# EAGLE design ESP32_Tiny (EAGLE 9.5.2)
DATE: 22-04-2019; REV: V1 P3; TITLE: TinyPICO
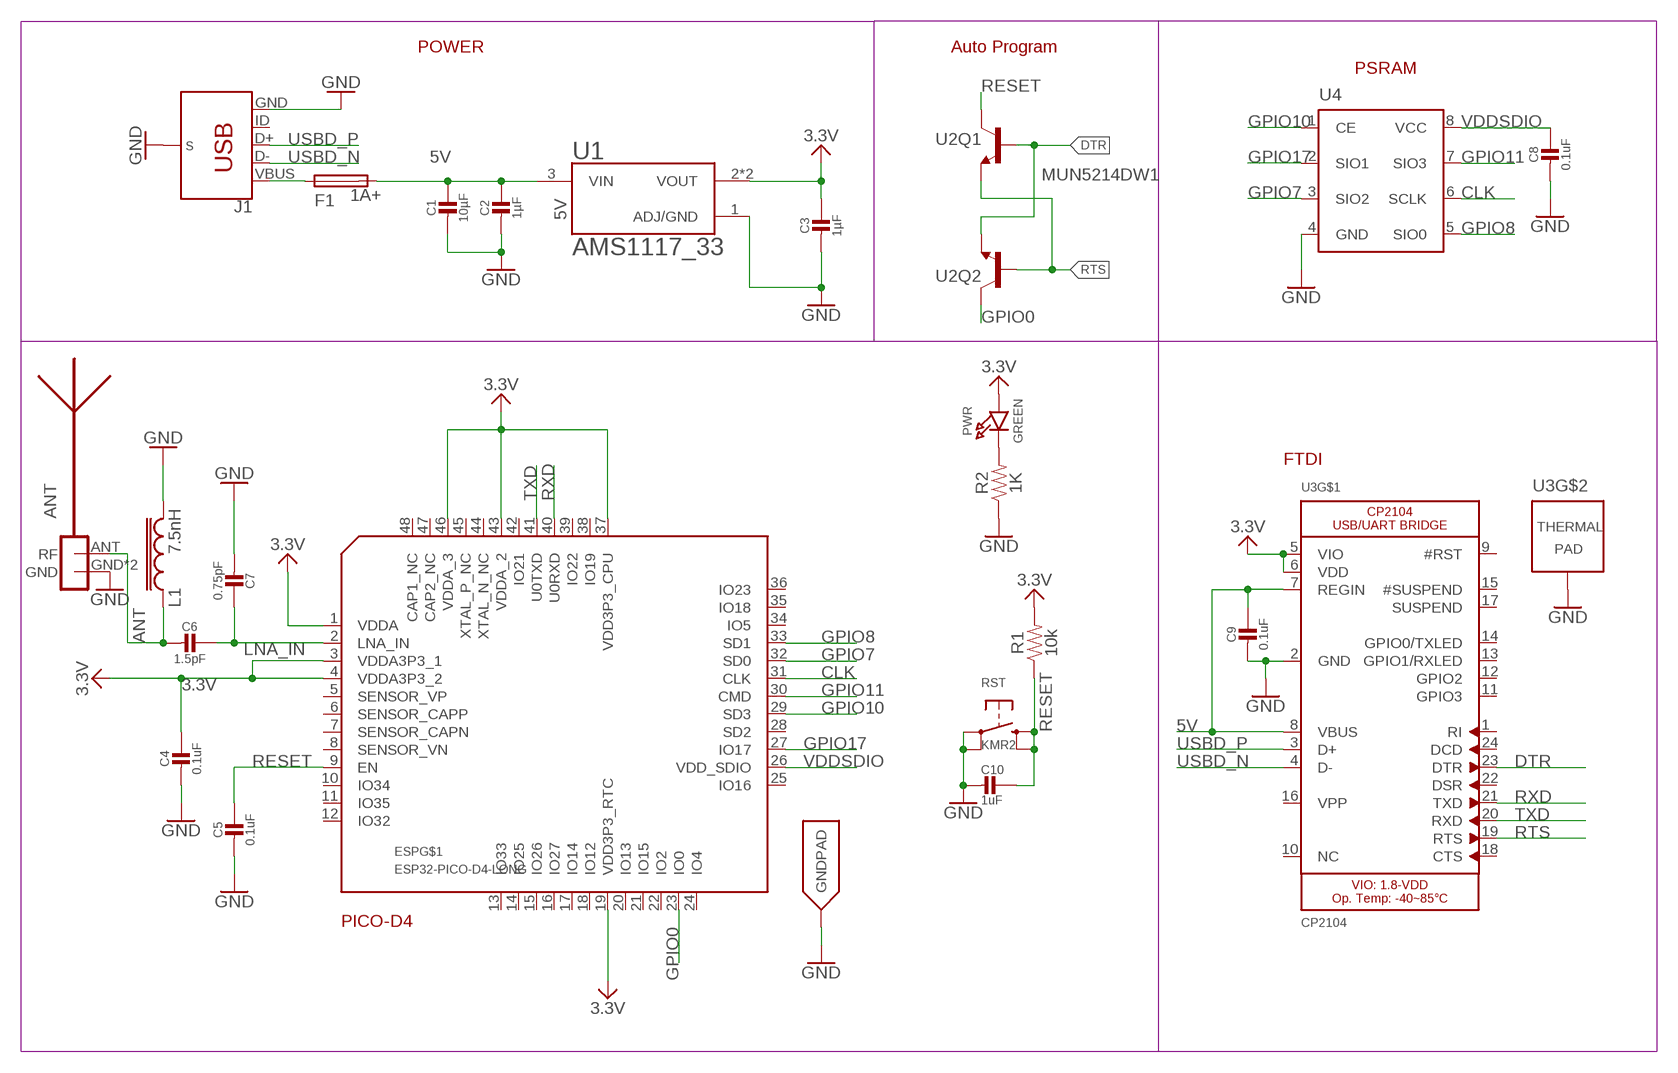
[diagram p0: schematic, sheet 1]

## Parts
ANT  AN043_2.45GREV1_RIGHT  [AN043_RIGHT]
C1  10µF  CAP_CERAMIC_0805  [0805]
C2  1µF  CAP_CERAMIC_0603  [0603]
C3  1µF  CAP_CERAMIC_0603  [0603]
C4  0.1uF  CAP_CERAMIC_0603  [0603]
C5  0.1uF  CAP_CERAMIC_0603  [0603]
C6  1.5pF  CAP_CERAMIC_0603  [0603]
C7  0.75pF  CAP_CERAMIC_0603  [0603]
C8  0.1uF  CAP_CERAMIC_0603  [0603]
C9  0.1uF  CAP_CERAMIC_0603  [0603]
C10  1uF  CAP_CERAMIC_0603  [0603]
ESP  ESP32-PICO-D4-LONG  [PICO-D4-QFN48-LONG]
F1  1A+  FUSE-1206  [1206]
J1  USB-MICRO-B-SOCKET-2  [USB-MICRO-B-SOCKET-2]
L1  7.5nH  INDUCTOR-0603  [0603]
PWR  GREEN  LED0603  [CHIPLED_0603]
R1  10k  RESISTOR0603  [0603]
R2  1K  RESISTOR0603  [0603]
RST  KMR2  SWITCH_TACT_SMT4.6X2.8  [BTN_KMR2_4.6X2.8]
U1  AMS1117_33  VREG_AMS1117SMALL  [SOT89]
U2  MUN5214DW1  NPN_MBT3904DW1T1  [DUAL_NPN_SC70-6]
U3  CP2104  FTDI_CP2104LONG  [QFN24_4MM_SMSC_LONG]
U4  LY68L6400SLIT  PSRAM_LY68L6400SLIT  [SOP8]

## Nets
3.3V: C3.1 C4.1 ESP.1(VDDA) ESP.3(VDDA3P3_1) ESP.4(VDDA3P3_2) ESP.19(VDD3P3_RTC) ESP.37(VDD3P3_CPU) ESP.43(VDDA_2) ESP.46(VDDA_3) PWR.A R1.2 U1.2(VOUT) U1.2@1(VOUT) U3.5(VIO) U3.6(VDD) ; supply symbol labelled SUPPLY_3.3V
5V: C1.1 C2.1 C9.1 F1.2 U1.3(VIN) U3.7(REGIN) U3.8(VBUS)
ANT: ANT.ANT(RF) C6.2 L1.1
CLK: ESP.31(CLK) U4.6(SCLK)
DTR: U2.1(Q2:E) U2.5(Q1:B) U3.23(DTR)
GND: ANT.GND ANT.GND-PAD1(GND) C1.2 C2.2 C3.2 C4.2 C5.2 C7.2 C8.2 C9.2 C10.2 ESP.EXP(GNDPAD) J1.GND J1.S1(SHIELD) J1.S2(SHIELD) J1.S3(SHIELD) J1.S4(SHIELD) J1.S5(SHIELD) L1.2 R2.1 RST.A'(P1) RST.A(P) U1.1(ADJ/GND) U3.2(GND) U3.THERM(TP) U4.4(GND) ; supply symbol labelled SUPPLY_GND
GPIO0: ESP.23(IO0) U2.6(Q2:C)
GPIO7: ESP.32(SD0) U4.3(SIO2)
GPIO8: ESP.33(SD1) U4.5(SIO0)
GPIO10: ESP.29(SD3) U4.1(CE)
GPIO11: ESP.30(CMD) U4.7(SIO3)
GPIO17: ESP.27(IO17) U4.2(SIO1)
LNA_IN: C6.1 C7.1 ESP.2(LNA_IN)
N$1: F1.1 J1.VBUS
N$2: PWR.C R2.2
RESET: C5.1 C10.1 ESP.9(EN) R1.1 RST.B'(S1) RST.B(S) U2.3(Q1:C)
RTS: U2.2(Q2:B) U2.4(Q1:E) U3.19(RTS)
RXD: ESP.40(U0RXD) U3.21(TXD)
TXD: ESP.41(U0TXD) U3.20(RXD)
USBD_N: J1.D- U3.4(D-)
USBD_P: J1.D+ U3.3(D+)
VDDSDIO: C8.1 ESP.26(VDD_SDIO) U4.8(VCC)
Unconnected: ESP.5(SENSOR_VP) ESP.6(SENSOR_CAPP) ESP.7(SENSOR_CAPN) ESP.8(SENSOR_VN) ESP.10(IO34) ESP.11(IO35) ESP.12(IO32) ESP.13(IO33) ESP.14(IO25) ESP.15(IO26) ESP.16(IO27) ESP.17(IO14) ESP.18(IO12) ESP.20(IO13) ESP.21(IO15) ESP.22(IO2) ESP.24(IO4) ESP.25(IO16) ESP.28(SD2) ESP.34(IO5) ESP.35(IO18) ESP.36(IO23) ESP.38(IO19) ESP.39(IO22) ESP.42(IO21) ESP.44(XTAL_N_NC) ESP.45(XTAL_P_NC) ESP.47(CAP2_NC) ESP.48(CAP1_NC) J1.ID U3.1(RI) U3.9(#RST) U3.10(NC) U3.11(GPIO3) U3.12(GPIO2) U3.13(GPIO1/RXLED) U3.14(GPIO0/TXLED) U3.15(#SUSPEND) U3.16(VPP) U3.17(SUSPEND) U3.18(CTS) U3.22(DSR) U3.24(DCD)

## Notes on the sheet
- POWER | Auto Program
- PSRAM
- FTDI
- PICO-D4

## Library data of the parts
ANT = Scott-RF:AN043_2.45G
C1-C10 = Scott-Electrical:CAP_CERAMIC
ESP = Scott-MCU:ESP32-PICO-D4
F1 = Scott-Electrical:FUSE
J1 = Scott-Connectors:USB-MICRO-B-SOCKET-
L1 = Scott-Electrical:INDUCTOR
PWR = Scott-Electrical:LED: LED 0603 - 0603 Surface Mount Package 2mA: Green LED - Low Power (3.9mcd, 2ma, 1.7Vf) - Digikey: 475-2709-2-ND Orange LED - Low Power (9.8mcd, 2ma, 1.8Vf) - Digikey: 475-1194-2-ND Red LED - Low Power (5mcd, 2ma, 1.8Vf) - Digikey: 475-1195-2-ND Yellow LED - Low Power (7mcd, 2ma, 1.8Vf) - Digikey: 475-1196-2-ND 5mA: Blue LED - Low Power (17mcd, 5ma, 2.9Vf) - Digikey: LNJ937W8CRACT-ND 0805 - 0805 Surface Mount Package 2mA: Red LED (8.8mcd, 2mA, 1.8Vf, Clear) - Low Power [Digikey: 475-2510-1-ND] Green LED (5mcd, 2mA, 1.8Vf, Clear) - Low Power [Digikey: 475-2730-1-ND] Yellow LED (11.3mcd, 2mA, 1.8Vf, Clear) - Low Power [Digikey: 475-2555-1-ND] 20mA: Red LED (104mcd, 20mA, Diffused) - LS R976 [Digikey: 475-1278-6-ND] Red LED (12mcd, 20mA, 2.0Vf, Clear) - APT2012EC [Digikey: 754-1128-1-ND] Green LED (15mcd, 20mA, 2.2Vf, Clear) - APT2012GC [Digikey: 754-1131-1-ND] Orange LED (160mcd, 20mA, 2.1Vf, Clear) - APT2012SECK [Digikey: 754-1130-1-ND] 1206 - 1206 Surface Mount Package Green LED (26mcd, 20mA, Diffused) - LG N971 [Digikey: 475-1407-6-ND] Red LED (15mcd, 20mA, Diffused) - LH N974 [Digikey: 475-1416-6-ND] Cree - Cree High-Power Surface Mount LEDs XPEBWT-L1-0000-00D50 - White 111lm 350mA 2.9Vf 6200K 110° XTEAWT-00-0000-00000LEE3 - White 114lm 350mA 2.85Vf 5000K 115° Everlight - Everlight 45-21 Series Surface Mount LEDs 45-21/QK2C-B2832AC2CB2/2T - Warm White 2000mcd 20mA 3.25Vf 3050K 120° 45-21/LK2C-B38452C4CB2/2T - Nuetral White 2000mcd 20mA 3.25Vf 4150K 120° 45-21/LK2C-B50634C6CB2/2T - Cold White 2200mcd 20mA 3.25Vf 5650K 120° PLCC2 Reverse Mount LS T77K-J1L2-1-0-2-R18-Z - Red 11.25mcd 2mA 1.8Vf 630nm 120° LO T77K-L1M2-24-Z - Orange 19.6mcd 2mA 1.8Vf 606nm 120° LY T77K-K2M1-26-Z - Yellow 15.7mcd 2mA 1.8Vf 587nm 120°
R1 R2 = Scott-Electrical:RESISTOR: Generic Resistor Package
RST = Scott-Switches:SWITCH_TACT_SMT: SMT Tact Switches 6x6mm - Digikey: P12940SCT-ND KMR2 (4.6x2.8mm) - Digikey: 401-1426-1-ND EVQ-PQHB55 - Light Touch, 160GF (4.5x4.5mm) - Digikey: P8090SCT-ND KMT0 - KMT021 NGJ LHS (etc.) IP68/Waterproof - Digikey: CKN10289CT-ND
U1 = Scott-ICs:VREG_AMS1117: 1-Amp Low Drop Out Voltage Regulatator
U2 = Scott-Electrical:NPN_MBT3904DW1T1: MBT3904DW1 Dual NPN Transistors The MBT3904W1 puts two general purpose 3904 NPN transistors in a single package. Datasheet <http://www.onsemi.com/pub_link/Collateral/MBT3904DW1T1-D.PDF>; PROD_ID: TRANS-13337
U3 = Scott-ICs:FTDI_CP2104: CP2104 - USB to UART Bridge VDD Output: 3.45V
U4 = Scott-ICs:PSRAM_LY68L6400SLIT: PSRAM for ESP32, etc

## Board
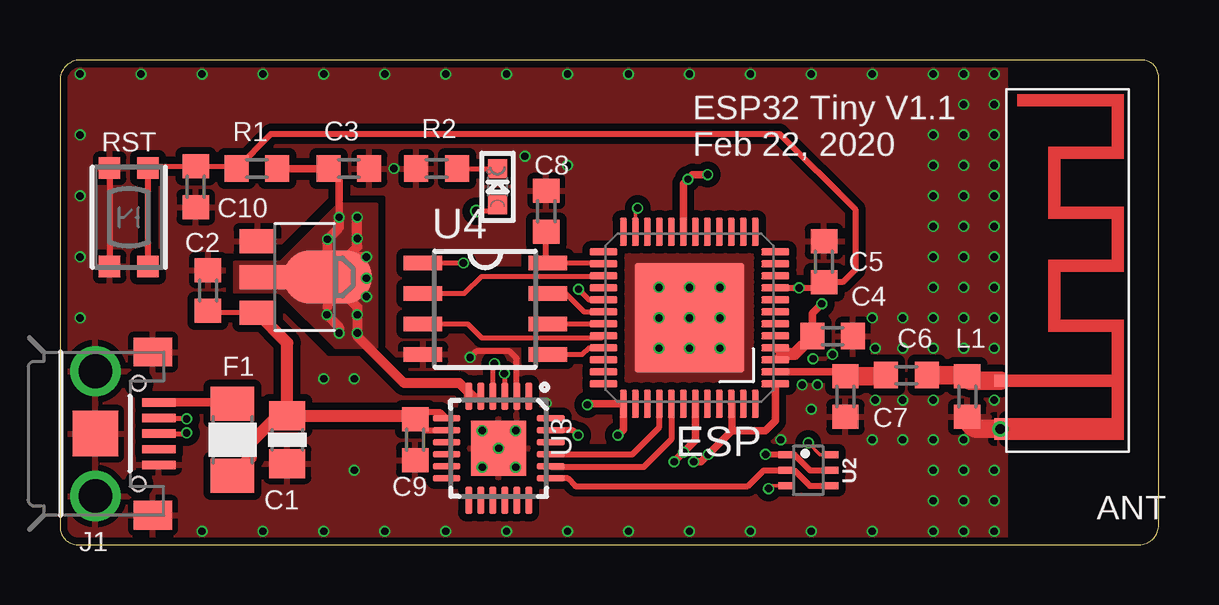
[diagram p1: board, top side]
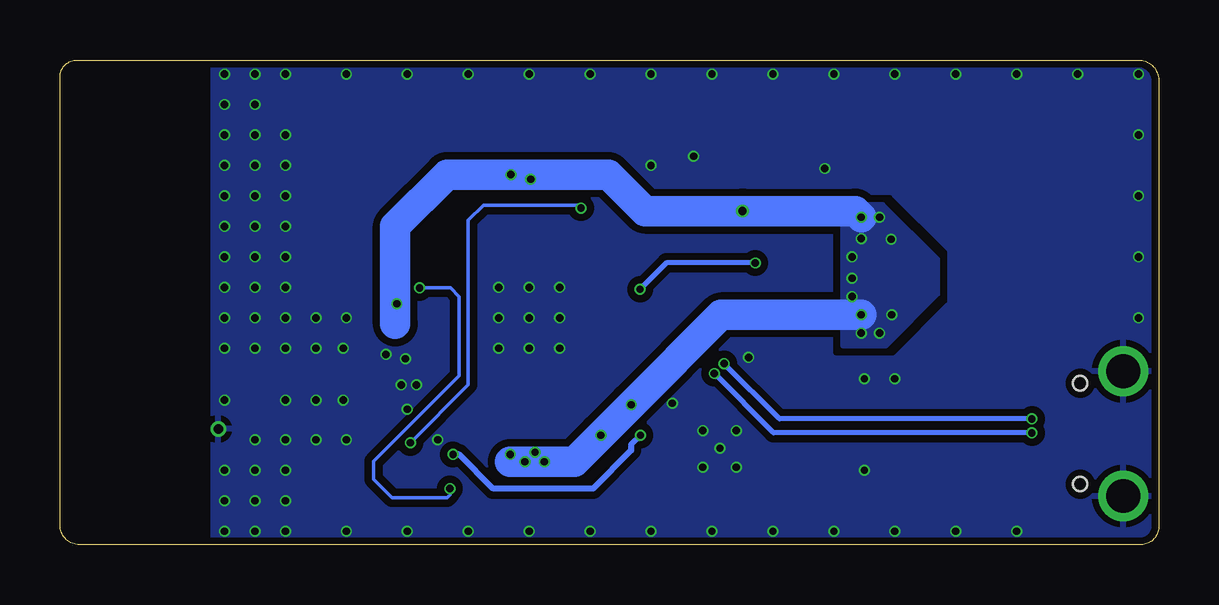
[diagram p2: board, bottom side, seen from below]

Size 45.8 x 20.19 mm. Coordinates in mm from the lower left corner, seen from the top.
Outline: 0,19.35 0,0.74 arc90 0.74,0 44.98,0 arc90 45.8,0.81 45.8,19.48 arc90 45.09,20.19 0.84,20.19 arc90 0,19.35
Copper layers (1*16): Top 0.035559375mm / dielectric 1.6mm / Bottom 0.035559375mm
Design rules "jlcpcb2layer": minimum track width 5mil, minimum drill 12mil, track to track 5mil, track to pad 5mil, pad to pad 5mil, via to via 5mil, smd to smd 5mil, copper to edge 8mil, drill to drill 6mil, minimum pad ring 5mil, minimum via ring 3mil, stop-mask expansion 2.5mil, vias tented up to drill 20mil, thermal gap 10mil

### Footprints (pad centres in the part's own frame; a part is rotated, then mirrored left to right if it is on the bottom)
AN043_RIGHT = smd 0.5 x 0.5: ANT -3.72,-2.79 | smd 0.9 x 0.5: GND -1.72,-2.79 | drill 0.4: GND-PAD1 -1.72,-2.79
0805 = smd 1.2 x 1.5: 1 -1,0; 2 1,0
0603 = smd 1 x 1.1: 1 -0.85,0; 2 0.85,0
PICO-D4-QFN48-LONG = smd 1.168 x 0.3: 1 -3.581,2.75; 2 -3.581,2.25; 3 -3.581,1.75; 4 -3.581,1.25; 5 -3.581,0.75; 6 -3.581,0.25; 7 -3.581,-0.25; 8 -3.581,-0.75; 9 -3.581,-1.25; 10 -3.581,-1.75; 11 -3.581,-2.25; 12 -3.581,-2.75; 25 3.581,-2.75; 26 3.581,-2.25; 27 3.581,-1.75; 28 3.581,-1.25; 29 3.581,-0.75; 30 3.581,-0.25; 31 3.581,0.25; 32 3.581,0.75; 33 3.581,1.25; 34 3.581,1.75; 35 3.581,2.25; 36 3.581,2.75 | smd 0.3 x 1.168: 13 -2.75,-3.581; 14 -2.25,-3.581; 15 -1.75,-3.581; 16 -1.25,-3.581; 17 -0.75,-3.581; 18 -0.25,-3.581; 19 0.25,-3.581; 20 0.75,-3.581; 21 1.25,-3.581; 22 1.75,-3.581; 23 2.25,-3.581; 24 2.75,-3.581; 37 2.75,3.581; 38 2.25,3.581; 39 1.75,3.581; 40 1.25,3.581; 41 0.75,3.581; 42 0.25,3.581; 43 -0.25,3.581; 44 -0.75,3.581; 45 -1.25,3.581; 46 -1.75,3.581; 47 -2.25,3.581; 48 -2.75,3.581 | smd 4.572 x 4.572: EXP 0,0
1206 = smd 1.4 x 1.803: 1 -1.5,0; 2 1.5,0
USB-MICRO-B-SOCKET-2 = smd 1.4 x 0.35: D+ -2.65,0; D- -2.65,-0.65; GND -2.65,1.3; ID -2.65,0.65; VBUS -2.65,-1.3 | drill 1.4: S1 0,2.6; S2 0,-2.6 | smd 1.9 x 1.9: S3 0,0 | smd 1.6 x 1.2: S4 -2.4,3.4; S5 -2.4,-3.4 | hole 0.6: -1.8,2.1; -1.8,-2.1
CHIPLED_0603 = smd 0.8 x 0.8: A 0,-0.75; C 0,0.75
BTN_KMR2_4.6X2.8 = smd 0.9 x 0.9: A 2.05,0.8; A' -2.05,0.8; B 2.05,-0.8; B' -2.05,-0.8
SOT89 = smd 1 x 1.5: 1 -1.499,-1.981; 3 1.499,-1.981 | smd 1 x 2: 2 0,-1.727 | smd 2.2 x 3.7: 2@1 0,0.94
DUAL_NPN_SC70-6 = smd 0.3 x 0.66: 1 -0.65,-0.92; 2 0,-0.92; 3 0.65,-0.92; 4 0.65,0.92; 5 0,0.92; 6 -0.65,0.92
QFN24_4MM_SMSC_LONG = smd 1.143 x 0.28: 1 -2.172,1.25; 2 -2.172,0.75; 3 -2.172,0.25; 4 -2.172,-0.25; 5 -2.172,-0.75; 6 -2.172,-1.25; 13 2.172,-1.25; 14 2.172,-0.75; 15 2.172,-0.25; 16 2.172,0.25; 17 2.172,0.75; 18 2.172,1.25 | smd 0.28 x 1.143: 7 -1.25,-2.172; 8 -0.75,-2.172; 9 -0.25,-2.172; 10 0.25,-2.172; 11 0.75,-2.172; 12 1.25,-2.172; 19 1.25,2.172; 20 0.75,2.172; 21 0.25,2.172; 22 -0.25,2.172; 23 -0.75,2.172; 24 -1.25,2.172 | smd 2.286 x 2.286: THERM 0,0
SOP8 = smd 0.6 x 1.6: 1 -1.905,-2.6; 2 -0.635,-2.6; 3 0.635,-2.6; 4 1.905,-2.6; 5 1.905,2.6; 6 0.635,2.6; 7 -0.635,2.6; 8 -1.905,2.6

### Placement (x,y rotation side)
ANT  41.99,3.1 270 top
C1  9.47,4.37 270 top
C2  6.17,10.59 90 top
C3  12.04,15.67 0 top
C4  32.21,8.69 0 top
C5  31.85,11.79 90 top
C6  35.28,7.06 0 top
C7  32.74,6.17 270 top
C8  20.27,13.89 90 top
C9  14.81,4.37 270 top
C10  5.66,14.91 270 top
ESP  26.24,9.45 180 top
F1  7.19,4.37 270 top
J1  1.47,4.62 180 top
L1  37.82,6.17 270 top
PWR  18.24,14.91 0 top
R1  8.2,15.67 0 top
R2  15.7,15.67 0 top
RST  2.87,13.64 90 top
U1  10.21,11.15 270 top
U2  31.19,3.1 270 top
U3  18.29,4.01 270 top
U4  17.73,9.83 270 top

### Tracks (layer width: path | path; a pad name or v marks a point on that pad's centre or on a via)
3.3V  (via drill 0.3, 0.35)
  Top 0.203: U3.5 U3.6 | PWR.A 17.97,13.89 v17.35,13.89
  Top 0.254: U1.2@1 11.44,11.44
  Top 0.305: 28.02,4.75 v27.03,3.76 26.72,3.45 v26.42,3.45 | v31.76,10.04 31.36,9.64 C4.1 | 30.1,7.95 30.07,7.95 | 30.07,7.95 ESP.3 | 30.07,7.95 ESP.4 | 28.02,4.75 29.41,4.75 29.82,5.16 ESP.1 | ESP.43 26.49,4.34 v26,3.85 v25.6,3.45 | ESP.19 25.99,15.04 v26.17,15.23 26.37,15.42 v27,15.42 | ESP.46 28.02,5.84 28.02,4.75 | R1.2 C3.1 11.63,15.23 v11.63,13.64 | v23.25,4.56 23.49,4.79 ESP.37 22.02,5.87 v21.98,5.83
  Top 0.406: U3.6 17.2,6.18 16.65,6.73 14.35,6.73 12.4,8.69 v12.4,8.81 v12.4,9.58 12.4,9.91 U1.2@1 | U1.2@1 11.15,9.93 | U1.2 U1.2@1 | U1.2@1 v11.15,12.72 11.63,13.21 v11.63,13.64 | U1.2@1 12.4,12.39 v12.4,12.75 v12.4,13.64 | 11.15,9.6 v11.13,9.58 11.63,9.07 v11.63,8.81 | U1.2@1 12.73,11.15 v12.78,11.1 | U1.2@1 11.99,11.99 v12.78,11.99 | U1.2@1 11.96,11.15 v12.78,10.34
  Top 0.508: 30.1,7.95 30.62,7.95 C4.1
  Bottom 0.508: v31.76,10.04 31.83,9.97 31.83,9.19
  Bottom 1.27: 31.83,9.19 31.83,13.26 29.67,15.42 v27,15.42 22.94,15.42 21.41,13.89 v17.35,13.89 12.65,13.89 v12.4,13.64 | 27.03,3.45 v26.42,3.45 v25.6,3.45 24.36,3.45 v23.25,4.56 v21.98,5.83 18.24,9.58 v12.4,9.58
  pour Top (isolate 0.305, no thermals): 7.32,11.71 7.32,10.57 9.22,10.57 11.51,8.28 13.16,8.28 13.16,14.12 11.63,14.12 9.22,11.71
  pour Bottom (isolate 0.305, no thermals): 9.22,11.86 11.51,14.15 13.16,14.15 13.16,8.31 11.38,8.31 9.22,10.46
5V
  Top 0.203: U1.3 6.26,9.65 C2.1
  Top 0.254: C9.1 15.26,4.76 U3.8 | U3.7 15.87,5.51 14.8,5.51 14.66,5.37
  Top 0.508: F1.2 7.95,3.63 7.95,4.24 9.08,5.37 C1.1 | C1.1 9.47,8.41 U1.3 | C1.1 14.66,5.37 C9.1
ANT
  Top 0.762: C6.2 37.78,7.06 L1.1 arc90 38.02,6.82 ANT.ANT
CLK
  Top 0.203: U4.6 ESP.31
DTR  (via drill 0.3)
  Top 0.254: v29.41,3.76 U2.1 30.62,3.75 31.27,3.1 U2.5 | v21.6,4.56 21.4,4.76 U3.23
  Bottom 0.254: v29.41,3.76 29.16,3.76 27.74,2.34 23.57,2.34 21.99,3.92 21.99,4.17 v21.6,4.56
GND  (via drill 0.3)
  Top 0.254: U3.2 19.04,7.76 18.75,8.05 17.35,8.05 v17.09,7.8 | RST.A RST.A'
  Top 0.762: L1.2 arc90 38.32,4.82 ANT.GND-PAD1
  other vias: 31.39,7.75 30.94,6.65 31.57,6.65 32.21,7.92 38.94,8.18 38.94,9.45 38.94,10.72 38.94,11.99 38.94,13.26 38.94,14.53 38.94,15.8 38.94,17.07 38.94,18.34 38.94,19.61 38.94,3.1 38.94,1.83 38.94,0.56 38.94,6.02 37.67,8.18 36.4,8.18 35.13,8.18 33.99,8.18 36.4,6.02 35.13,6.02 33.99,6.02 26.24,9.45 27.51,9.45 24.97,9.45 24.97,10.72 26.24,10.72 27.51,10.72 27.51,8.18 26.24,8.18 24.97,8.18 18.29,4.01 21.16,15.8 11,6.91 12.27,6.91 31.32,5.64 30.05,4.37 12.27,3.1 36.4,0.56 33.86,0.56 31.32,0.56 28.78,0.56 26.24,0.56 23.7,0.56 21.16,0.56 18.62,0.56 16.08,0.56 13.54,0.56 11,0.56 8.46,0.56 5.92,0.56 36.4,19.61 33.86,19.61 31.32,19.61 28.78,19.61 26.24,19.61 23.7,19.61 21.16,19.61 18.62,19.61 16.08,19.61 13.54,19.61 11,19.61 8.46,19.61 5.92,19.61 3.38,19.61 0.84,19.61 0.84,17.07 0.84,14.53 0.84,11.99 0.84,9.45 37.67,17.07 37.67,15.8 37.67,14.53 37.67,13.26 37.67,11.99 37.67,10.72 37.67,9.45 37.67,3.1 37.67,1.83 37.67,4.37 36.4,4.37 36.4,3.1 36.4,1.83 35.13,4.37 33.86,4.37 36.4,9.45 36.4,10.72 36.4,11.99 36.4,13.26 36.4,14.53 36.4,15.8 35.13,9.45 33.86,9.45 37.67,0.56 37.67,18.34 36.4,17.07 37.67,19.61 20.27,5.89 17.6,4.75 19,4.75 19,3.23 17.6,3.23 13.92,15.67 19.38,16.18
  pour Top (isolate 0.305, rank 6): -0.43,-0.25 -0.43,20.27 39.45,20.27 39.45,-0.25
  pour Bottom (isolate 0.305, rank 6): -0.43,20.27 39.45,20.27 39.45,-0.25 -0.43,-0.25
  pour Top (isolate 0.305, no thermals): 22.43,14.53 30.05,14.53 30.05,5.64 22.43,5.64
GPIO0  (via drill 0.3)
  Top 0.152: U2.6 31.68,3.75 v31.19,4.24 | v24.08,14.02 23.99,13.93 ESP.23
  Bottom 0.152: v31.19,4.24 28.78,6.65 28.78,13.51 28.14,14.15 24.21,14.15 v24.08,14.02
GPIO7
  Top 0.203: U4.3 16.99,9.19 17.58,8.61 22.57,8.61 ESP.32
GPIO8
  Top 0.203: U4.5 21.77,7.92 22.04,8.2 ESP.33
GPIO10  (via drill 0.3)
  Top 0.203: U4.1 v16.82,11.73 | v21.62,10.64 22.06,10.2 ESP.29
  Bottom 0.203: v16.82,11.73 20.52,11.73 v21.62,10.64
GPIO11
  Top 0.203: U4.7 21.08,10.46 21.85,9.7 ESP.30
GPIO17
  Top 0.203: ESP.27 22.64,11.18 17.56,11.18 16.85,10.46 U4.2
LNA_IN
  Top 0.305: C7.1 32.56,7.2 ESP.2
  Top 0.762: C7.1 34.39,7.02
  Top 1.016: 34.39,7.02 C6.1
N$1
  Top 0.356: J1.VBUS 7.13,5.92 F1.1
N$2
  Top 0.203: R2.2 18.23,15.67 PWR.C
RESET  (via drill 0.3)
  Top 0.152: U2.3 29.65,2.45 v29.54,2.34
  Top 0.203: R1.1 7.27,15.76 C10.1 3.74,15.76 RST.B
  Top 0.254: ESP.9 v30.81,10.7 31.62,10.7 C5.1 32.63,10.94 33.15,11.46 33.15,13.97 30,17.12 8.8,17.12 R1.1 | RST.B' RST.B
  Bottom 0.152: v29.54,2.34 29.54,2.08 29.67,1.96 31.95,1.96 32.72,2.72 32.72,3.48 29.16,7.04 29.16,10.34 29.52,10.7 v30.81,10.7
RTS
  Top 0.254: U2.4 31.26,2.45 30.61,3.1 U2.2 29.34,3.1 28.68,2.44 21.49,2.44 21.17,2.76 U3.19
RXD
  Top 0.254: U3.21 23.85,3.76 24.99,4.9 ESP.40
TXD
  Top 0.254: ESP.41 25.49,4.38 24.33,3.23 20.5,3.23 U3.20
USBD_N  (via drill 0.3)
  Top 0.203: J1.D- 5.23,5.27 5.26,5.24 v5.28,5.24 | U3.4 18.04,7.47 v18.11,7.54
  Bottom 0.203: v5.28,5.24 15.81,5.24 v18.11,7.54
USBD_P  (via drill 0.3)
  Top 0.203: J1.D+ 5.23,4.62 5.26,4.66 v5.28,4.66 | U3.3 18.54,7.12 v18.52,7.13
  Bottom 0.203: v5.28,4.66 16.05,4.66 v18.52,7.13
VDDSDIO
  Top 0.203: U4.8 22.62,11.73 ESP.26
  Top 0.254: U4.8 20.27,11.79 C8.1

### Text on the board
tPlace: ESP32 Tiny V1.1 / Feb 22, 2020